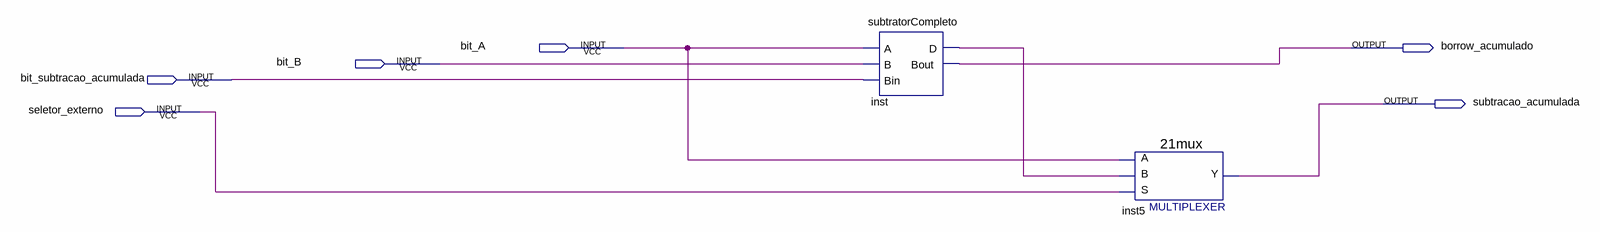
[diagram p0: schematic sheet]
// Quartus schematic divisorModulo.bdf as structural Verilog: 2 symbols, 6 pins
module divisorModulo (
  input  bit_A,
  input  bit_B,
  input  bit_subtracao_acumulada,
  input  seletor_externo,
  output borrow_acumulado,
  output subtracao_acumulada
);

  wire inst_d;

  subtratorCompleto inst (.A(bit_A), .B(bit_B), .Bin(bit_subtracao_acumulada), .D(inst_d), .Bout(borrow_acumulado));
  \21mux  inst5 (.S(seletor_externo), .B(inst_d), .A(bit_A), .Y(subtracao_acumulada));
endmodule
